# Altium schematic sheet Power.SchDoc: Power
size A4; Date: Not used; ApprovedBy: Not used; CheckedBy: Not used; Author: Not used; CompanyName: STMicroelectronics; DrawnBy: Not used; Engineer: Not used; Organization: Not used; Address1: Not used; Address2: Not used; Address3: Not used; Address4: Not used; DocumentNumber: Not used; Revision: Not used; SheetNumber: 5; SheetTotal: 6; CurrentTime: Not used; CurrentDate: Not used; Time: Not used; DocumentFullPathAndName: Not used; DocumentName: Not used; ModifiedDate: Not used; ImagePath: Not used; ProjectName: Not used; Application_BuildNumber: Not used
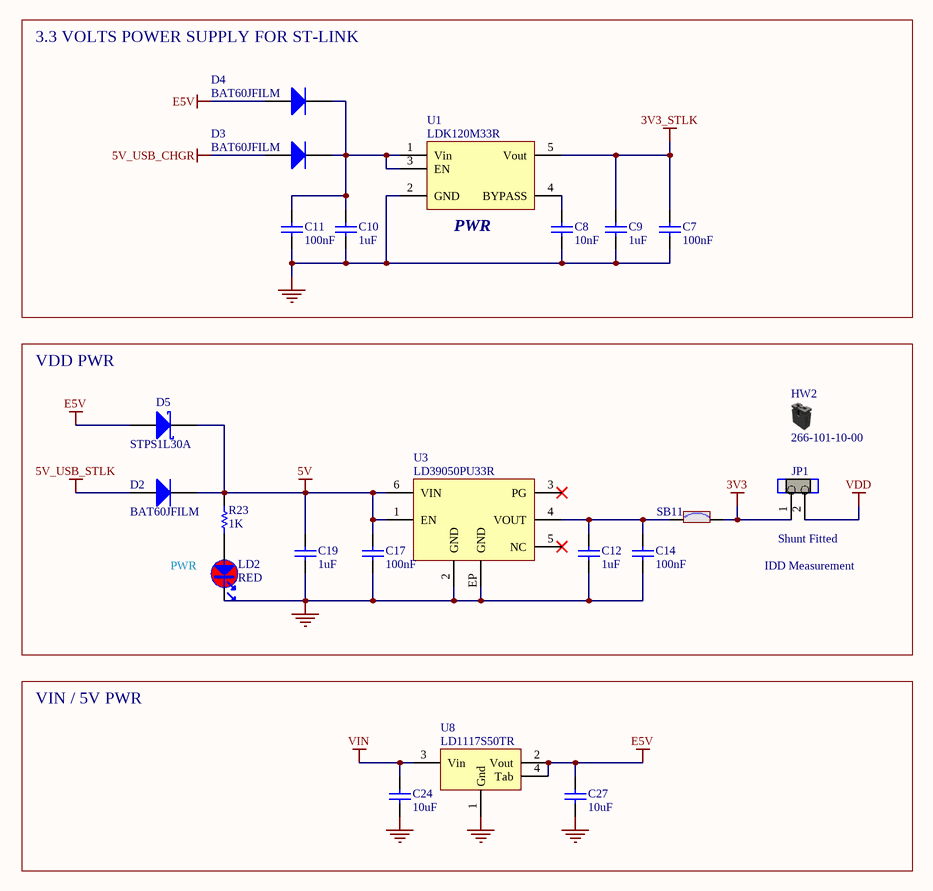
[diagram p0: Power.SchDoc]

## Parts
C7  value 100nF  [C0402]  (hidden comment: Capacitor)
C8  value 10nF  [C0402]  (hidden comment: Capacitor)
C9  value 1uF  [C0402]  (hidden comment: Capacitor)
C10  value 1uF  [C0402]  (hidden comment: Capacitor)
C11  value 100nF  [C0402]  (hidden comment: Capacitor)
C12  value 1uF  [C0402]  (hidden comment: Capacitor)
C14  value 100nF  [C0402]  (hidden comment: Capacitor)
C17  value 100nF  [C0402]  (hidden comment: Capacitor)
C19  value 1uF  [C0402]  (hidden comment: Capacitor)
C24  value 10uF  [C0805]  (hidden comment: Capacitor)
C27  value 10uF  [C0805]  (hidden comment: Capacitor)
D2  BAT60JFILM  [DIO_SOD323]
D3  BAT60JFILM  [DIO_SOD323]
D4  BAT60JFILM  [DIO_SOD323]
D5  value STPS1L30A  [DIO_SMA_1A_2K]  (hidden comment: STPS1L40M)
HW2  value 266-101-10-00  (hidden comment: Shunt Black 1.27mm 266-101-10-00)  (mechanical)
JP1  value Shunt Fitted  [CON_WP_707-2-02-2-20-00]  (hidden comment: Jumper_Header1.27 2x1 Fitted)
LD2  value RED  [LED_0603_RED_H0P4]  (hidden comment: LED_red)
R23  value 1K  [R0402]  (hidden comment: Resistor)
SB11  SB_ON  [SOLDER-BRIDGE_R0603-0R]  (value not drawn)
U1  LDK120M33R  [REG_SOT23-5L]
U3  LD39050PU33R  [ICC_DFN6-EPAD_3X3_P095]
U8  LD1117S50TR  [REG_SOT223-TAB]

## Blocks framed on the sheet
VDD PWR: C12 C14 C17 C19 D2 D5 HW2 JP1 LD2 R23 SB11 U3
VIN / 5V PWR: C24 C27 U8

## Nets
3V3: JP1.1 SB11.2
3V3_STLK: C7.2 C9.2 U1.5(Vout)
5V: C17.2 C19.2 D2.2(K) D5.2(K) R23.2 U3.1(EN) U3.6(VIN)
5V_USB_CHGR: D3.1(A)
5V_USB_STLK: D2.1(A)
E5V: C27.2 D4.1(A) D5.1(A) U8.2(Vout) U8.4(Tab)
GND: C7.1 C8.1 C9.1 C10.1 C11.1 C12.1 C14.1 C17.1 C19.1 C24.1 C27.1 LD2.2 U1.2(GND) U3.2(GND) U3.EP(GND) U8.1(Gnd)
VDD: JP1.2
VIN: C24.2 U8.3(Vin)
NetC8_2: C8.2 U1.4(BYPASS)
NetC10_2: C10.2 C11.2 D3.2(K) D4.2(K) U1.1(Vin) U1.3(EN)
NetC12_2: C12.2 C14.2 SB11.1 U3.4(VOUT)
NetLD2_1: LD2.1 R23.1

Not connected (* = marked no-connect by the designer): U3 3(PG)* 5(NC)*

## Notes on the sheet
- 3.3 VOLTS POWER SUPPLY FOR ST-LINK
- (near U1) PWR
- PWR
- IDD Measurement
- Title:
- Project:
- Size:
- Revision:
- Variant:
- A4
- -
- Date:
- Reference:
- Sheet:
- of

## Library data of the parts
C7 C11 C14 C17 = MCD-00102: Capacitor, MLCC, 100nF, 16V, X7R, 10%, 0402, T=0,5mm; Manufacturer_Part_Number: CC0402KRX7R7BB104; Manufacturer: YAGEO; Alternate_Manufacturer_Part_Number: GCM155R71C104KA55D; Alternate_Manufacturer: MURATA; Provided_By: SUBCO; ECCN_US: EAR99; ECCN_EU: NEC; Internal_Part_Number: MCD-00102; Status: Released; Package: C0402; ComponentLink1Description: Datasheet; Part_Type: Capacitor; ComponentLink1URL: http://tunmcdsvn.tun.st.com/Component_Datasheet_Library/Trunk/Capacitors/Yageo_Multilayer_Capacitor_X7R_series_100pF_to_22uF
C8 = MCD-00011: Capacitor, MLCC, 10nF, 16V, X7R, 10%, 0402, T=0.5mm; Manufacturer_Part_Number: CC0402KRX7R7BB103; Manufacturer: YAGEO; Provided_By: SUBCO; ECCN_US: EAR99; ECCN_EU: NEC; Internal_Part_Number: MCD-00011; Status: Released; Part_Type: Capacitor; Package: C0402; ComponentLink1Description: Datasheet; ComponentLink1URL: http://tunmcdsvn.tun.st.com/Component_Datasheet_Library/Trunk/Capacitors/Yageo_Multilayer_Capacitor_X7R_series_100pF_to_22uF
C9 C10 C12 C19 = MCD-00095: Capacitor, MLCC, 1uF, 6V3, X5R, 10%, 0402, T=0,5mm; Manufacturer_Part_Number: GRM155R61E105KA12; Manufacturer: MURATA; Alternate_Manufacturer_Part_Number: GRM155R60J105KE19; Provided_By: SUBCO; ECCN_US: EAR99; ECCN_EU: NEC; Internal_Part_Number: MCD-00095; Status: Released; Package: C0402; ComponentLink1Description: Datasheet; Part_Type: Capacitor; ComponentLink1URL: http://tunmcdsvn.tun.st.com/Component_Datasheet_Library/Trunk/Capacitors/Murata_Capacitor_GR_series; Alternate_Manufacturer: MURATA
C24 C27 = MCD-00014: Capacitor, MLCC, 10uF, 25V, X5R, 10%, 0805, T=0,85mm; Manufacturer_Part_Number: CC0805KRX5R8BB106; Manufacturer: YAGEO; Provided_By: SUBCO; ECCN_US: EAR99; ECCN_EU: NEC; Internal_Part_Number: MCD-00014; ComponentLink1Description: Datasheet; Status: Released; Part_Type: Capacitor; Package: C0805; ComponentLink1URL: http://tunmcdsvn.tun.st.com/Component_Datasheet_Library/Trunk/Capacitors/Yageo_Multilayer_capacitor_X5R_series_100pF_to_100uF
D2-D4 = MCD-00034: Part_Type: Diode; Manufacturer: STMICROELECTRONICS; BMS_Part_Number: 9151097; ECCN_US: EAR99; ECCN_EU: NEC; Provided_By: SUBCO with ST control; Internal_Part_Number: MCD-00034; Value: BAT60JFILM; Status: Released; Manufacturer_Part_Number: BAT60JFILM; ComponentLink1Description: Datasheet; ComponentLink1URL: http://tunmcdsvn.tun.st.com/Component_Datasheet_Library/Trunk/Diodes/STM_Diode_BAT60JFILM-SOD323
D5 = MCD-01059: LOW DROP POWER SCHOTTKY RECTIFIER 1A 30V VF=0.3V; Part_Type: Diode; Manufacturer: STMICROELECTRONICS; BMS_Part_Number: 9151096; Provided_By: SUBCO with ST control; ECCN_US: EAR99; ECCN_EU: NEC; Internal_Part_Number: MCD-01059; Status: Footprint available; Manufacturer_Part_Number: STPS1L30A; Package: DIO_SMA_1A_2K; ComponentLink1Description: Datasheet; ComponentLink1URL: http://tunmcdsvn.tun.st.com/Component_Datasheet_Library/Trunk/Diodes/STM_SCHOTTKY_STPS1L30
HW2 = MCD-01409: SHUNT 1.27mm BLACK; Part_Type: Mechanical; Manufacturer: W & P Products; Alternate_Manufacturer_Part_Number: M50-1900005; Alternate_Manufacturer: HARWIN; Provided_By: SUBCO; Internal_Part_Number: MCD-01409; Status: Checked; Manufacturer_Part_Number: 266-101-10-00; ComponentLink1Description: Datasheet; ComponentLink1URL: http://tunmcdsvn.tun.st.com/Component_Datasheet_Library/Trunk/Connectors/WPPRO_Shunt_Jumper_266; ECCN_US: n/a; ECCN_EU: n/a
JP1 = MCD-01428: Header, 2x1, 1,27mm, Right Angled, Single Row, Height 3.05mm/1.27mm; Part_Type: Connector; Manufacturer_Part_Number: 707-2-02-2-20-00; Manufacturer: W & P Products; Provided_By: SUBCO; Internal_Part_Number: MCD-01428; Status: Checked; ComponentLink1Description: Datasheet; ComponentLink1URL: http://tunmcdsvn.tun.st.com/Component_Datasheet_Library/Trunk/Connectors/WPPRO_connector_707-series; ECCN_US: n/a; ECCN_EU: n/a
LD2 = MCD-00322: LED, Red, 0603; Manufacturer_Part_Number: 19-217/R6C-AL1M2VY/3T; Manufacturer: EVERLIGHT; Part_Type: Display; Provided_By: SUBCO; ECCN_US: EAR99; ECCN_EU: NEC; Internal_Part_Number: MCD-00322; ComponentLink1Description: Datasheet; Status: Released; ComponentLink1URL: http://tunmcdsvn.tun.st.com/Component_Datasheet_Library/Trunk/Display/Everlight_SMD-LED-RED_19-213-R6C-AP1Q2B-3T-V3.doc; Package: LED 0603
R23 = MCD-00061: Resistor,1K,0402,1%,1/16W; Manufacturer_Part_Number: RC0402FR-071KL; Manufacturer: YAGEO; Provided_By: SUBCO; ECCN_US: EAR99; ECCN_EU: NEC; Internal_Part_Number: MCD-00061; Status: Released; Part_Type: Resistor; Package: R0402; ComponentLink1Description: Datasheet; ComponentLink1URL: http://tunmcdsvn.tun.st.com/Component_Datasheet_Library/Trunk/Resistors/Yageo_Resistor_RC0402-series
SB11 = MCD-00071: Solder Bridge ON; Part_Type: Mechanical; Manufacturer_Part_Number: RC0603JR-070RL; Manufacturer: YAGEO; Provided_By: SUBCO; Internal_Part_Number: MCD-00071; ECCN_US: n/a; ECCN_EU: n/a; Status: Released; Package: SB0603; ComponentLink1Description: Datasheet; ComponentLink1URL: http://tunmcdsvn.tun.st.com/Component_Datasheet_Library/Trunk/Resistors/Yageo_Resistor_RC0603-series
U1 = MCD-00663: 200 mA low quiescent current very low noise LDO; Part_Type: IC; Manufacturer: STMICROELECTRONICS; BMS_Part_Number: 9176330; ECCN_US: EAR99; ECCN_EU: NEC; Provided_By: SUBCO with ST control; Internal_Part_Number: MCD-00663; Value: LDK120M33R; Status: Footprint available; Manufacturer_Part_Number: LDK120M33R; Package: SOT23-5L; ComponentLink1Description: Datasheet; ComponentLink1URL: http://tunmcdsvn.tun.st.com/Component_Datasheet_Library/Trunk/IC/STM_LDO_LDK120M33R
U3 = MCD-00215: Low quiescent current and low noise voltage regulators; Manufacturer: STMICROELECTRONICS; Part_Type: IC; BMS_Part_Number: 9176126; Provided_By: SUBCO with ST control; ECCN_US: EAR99; ECCN_EU: NEC; Value: LD39050PU33R; Internal_Part_Number: MCD-00215; Manufacturer_Part_Number: LD39050PU33R; Status: Released; ComponentLink1Description: Datasheet; ComponentLink1URL: http://tunmcdsvn.tun.st.com/Component_Datasheet_Library/Trunk/IC/STM_LDO_LD39050PU; Package: DFN6 3x3mm
U8 = MCD-00088: IC REG LDO 5V 0.8A SOT223; Manufacturer: STMICROELECTRONICS; BMS_Part_Number: 9176133; Provided_By: SUBCO with ST control; ECCN_US: EAR99; ECCN_EU: NEC; Value: LD1117S50TR; Internal_Part_Number: MCD-00088; Manufacturer_Part_Number: LD1117S50TR; ComponentLink1Description: Datasheet; Status: Released; Part_Type: IC; ComponentLink1URL: http://tunmcdsvn.tun.st.com/Component_Datasheet_Library/Trunk/IC/STM_LDO_LD1117; Package: SOT-223